# EAGLE design IoTaWatt_V4_2 (EAGLE 7.4.0)
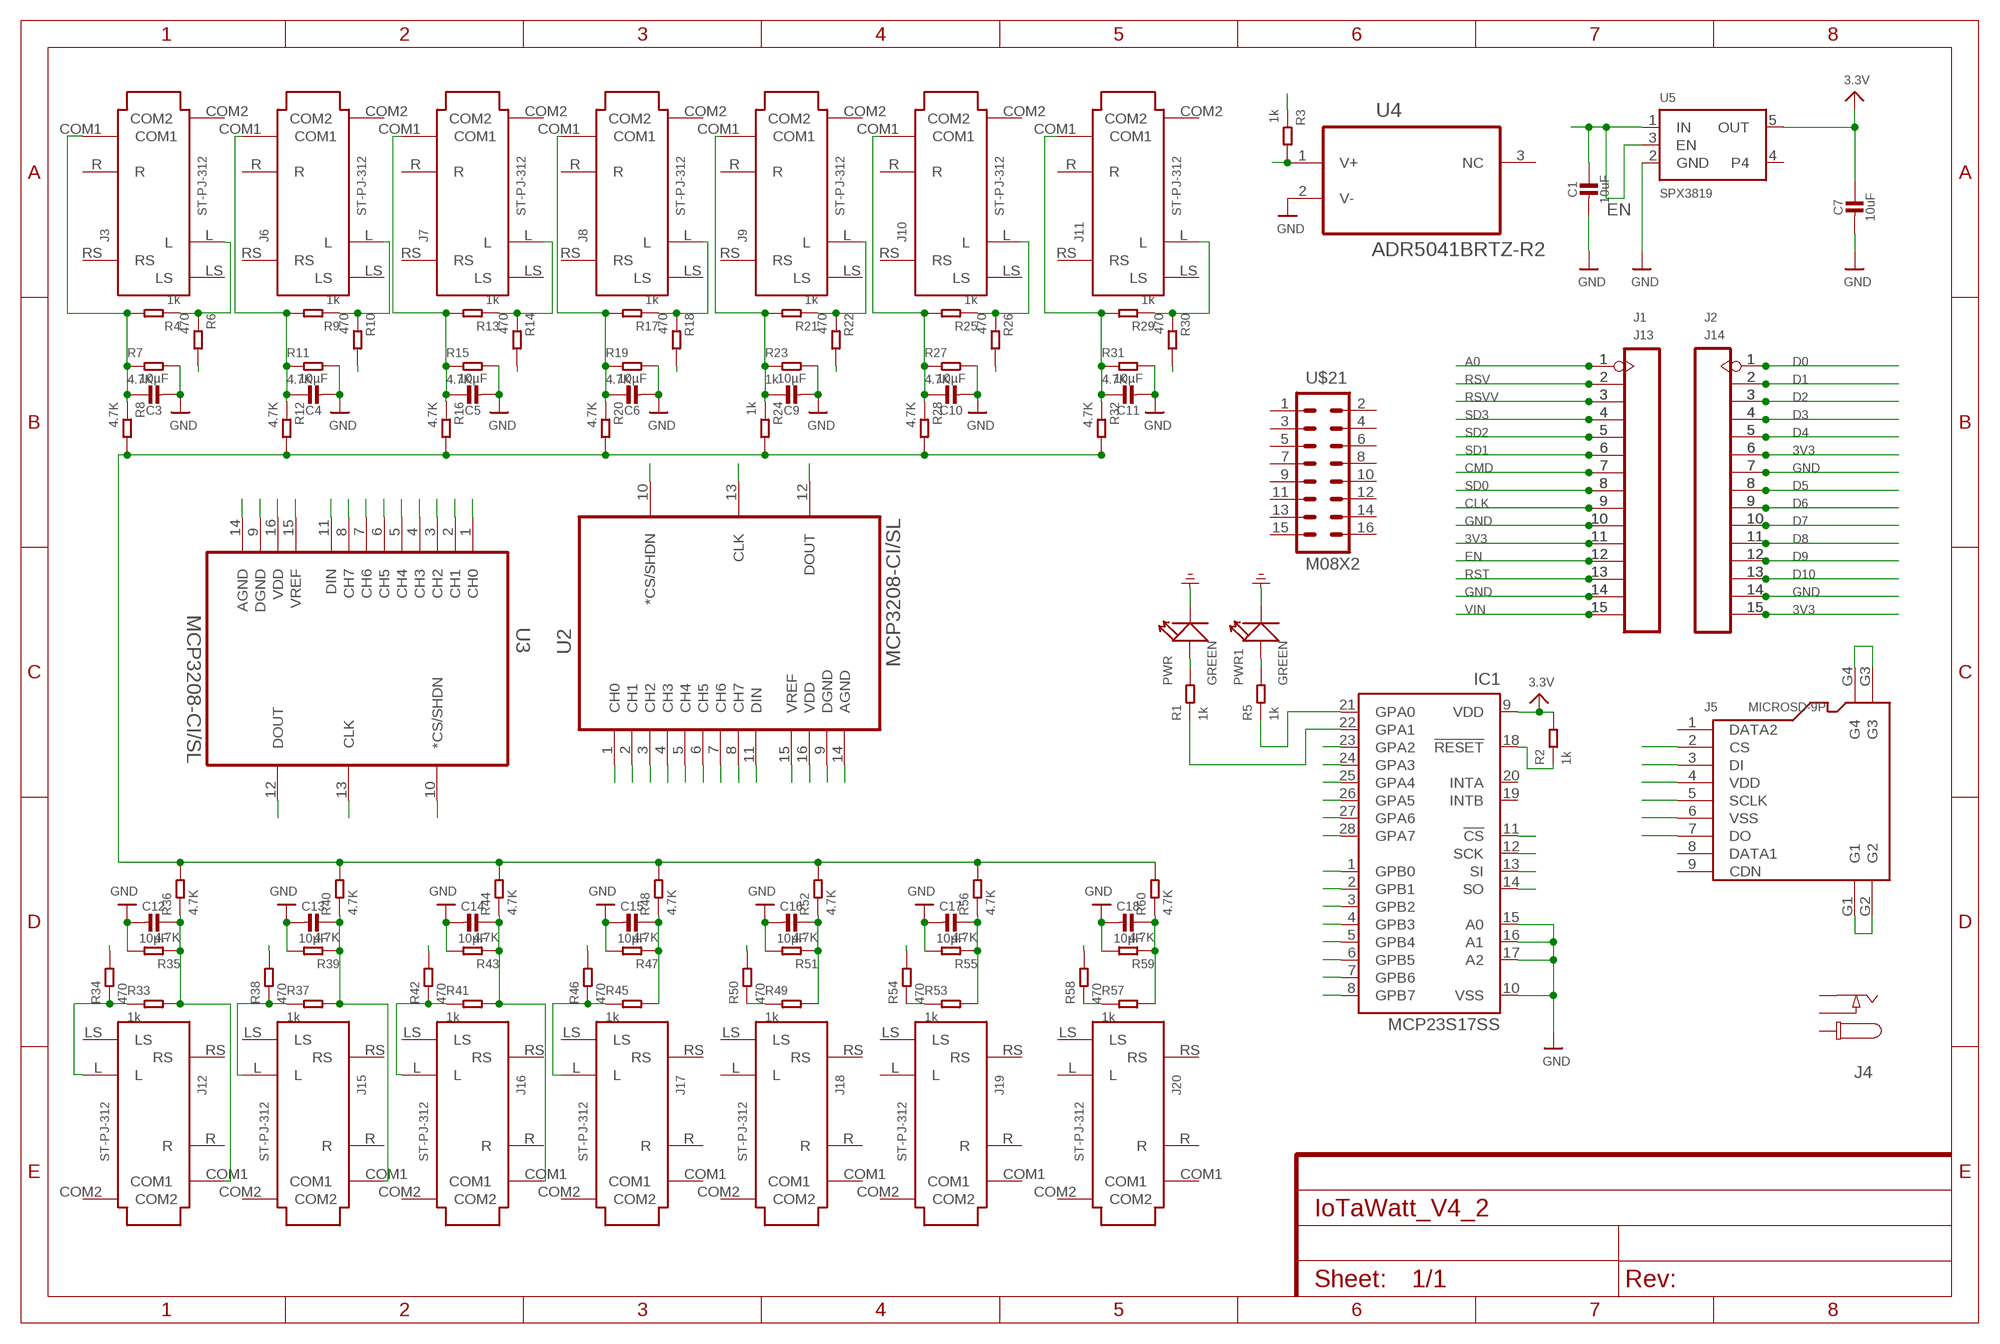
[diagram p0: schematic, sheet 1]

## Parts
C1  10uF  CAP_CERAMIC0603_NO  [0603-NO]
C3  10µF  CAP_CERAMIC0805-NOOUTLINE  [0805-NO]
C4  10µF  CAP_CERAMIC0805-NOOUTLINE  [0805-NO]
C5  10µF  CAP_CERAMIC0805-NOOUTLINE  [0805-NO]
C6  10µF  CAP_CERAMIC0805-NOOUTLINE  [0805-NO]
C7  10uF  CAP_CERAMIC0603_NO  [0603-NO]
C9  10µF  CAP_CERAMIC0805-NOOUTLINE  [0805-NO]
C10  10µF  CAP_CERAMIC0805-NOOUTLINE  [0805-NO]
C11  10µF  CAP_CERAMIC0805-NOOUTLINE  [0805-NO]
C12  10µF  CAP_CERAMIC0805-NOOUTLINE  [0805-NO]
C13  10µF  CAP_CERAMIC0805-NOOUTLINE  [0805-NO]
C14  10µF  CAP_CERAMIC0805-NOOUTLINE  [0805-NO]
C15  10µF  CAP_CERAMIC0805-NOOUTLINE  [0805-NO]
C16  10µF  CAP_CERAMIC0805-NOOUTLINE  [0805-NO]
C17  10µF  CAP_CERAMIC0805-NOOUTLINE  [0805-NO]
C18  10µF  CAP_CERAMIC0805-NOOUTLINE  [0805-NO]
IC1  MCP23S17SS  [SSOP28]
J1  HEADER-15P'2.54'  [H15-2.54]
J2  HEADER-15P'2.54'  [H15-2.54]
J3  ST-PJ-312  AUDIO-JACK-6P-SMD(ST-PJ-312)  [AUDIO6P-SMD-3.5-14.0X6.4X5.0MM]
J4  CON_DC_M-DC_SMD  [DC_BARREL_JACK_SMD_2MM]
J5  MICROSD-9P  MICRO-SD-CARD-HOLDER-9P  [MICRO-SD9+4P-SMD-16.1X14.5X1.85MM]
J6  ST-PJ-312  AUDIO-JACK-6P-SMD(ST-PJ-312)  [AUDIO6P-SMD-3.5-14.0X6.4X5.0MM]
J7  ST-PJ-312  AUDIO-JACK-6P-SMD(ST-PJ-312)  [AUDIO6P-SMD-3.5-14.0X6.4X5.0MM]
J8  ST-PJ-312  AUDIO-JACK-6P-SMD(ST-PJ-312)  [AUDIO6P-SMD-3.5-14.0X6.4X5.0MM]
J9  ST-PJ-312  AUDIO-JACK-6P-SMD(ST-PJ-312)  [AUDIO6P-SMD-3.5-14.0X6.4X5.0MM]
J10  ST-PJ-312  AUDIO-JACK-6P-SMD(ST-PJ-312)  [AUDIO6P-SMD-3.5-14.0X6.4X5.0MM]
J11  ST-PJ-312  AUDIO-JACK-6P-SMD(ST-PJ-312)  [AUDIO6P-SMD-3.5-14.0X6.4X5.0MM]
J12  ST-PJ-312  AUDIO-JACK-6P-SMD(ST-PJ-312)  [AUDIO6P-SMD-3.5-14.0X6.4X5.0MM]
J13  HEADER-15P'2.54'  [H15-2.54]
J14  HEADER-15P'2.54'  [H15-2.54]
J15  ST-PJ-312  AUDIO-JACK-6P-SMD(ST-PJ-312)  [AUDIO6P-SMD-3.5-14.0X6.4X5.0MM]
J16  ST-PJ-312  AUDIO-JACK-6P-SMD(ST-PJ-312)  [AUDIO6P-SMD-3.5-14.0X6.4X5.0MM]
J17  ST-PJ-312  AUDIO-JACK-6P-SMD(ST-PJ-312)  [AUDIO6P-SMD-3.5-14.0X6.4X5.0MM]
J18  ST-PJ-312  AUDIO-JACK-6P-SMD(ST-PJ-312)  [AUDIO6P-SMD-3.5-14.0X6.4X5.0MM]
J19  ST-PJ-312  AUDIO-JACK-6P-SMD(ST-PJ-312)  [AUDIO6P-SMD-3.5-14.0X6.4X5.0MM]
J20  ST-PJ-312  AUDIO-JACK-6P-SMD(ST-PJ-312)  [AUDIO6P-SMD-3.5-14.0X6.4X5.0MM]
PWR  GREEN  LED'0603'  [LED-0603]
PWR1  GREEN  LED'0603'  [LED-0603]
R1  1k  RES-0603  [R0603]
R2  1k  RES-0603  [R0603]
R3  1k  RES-0603  [R0603]
R4  1k  RES-0603  [R0603]
R5  1k  RES-0603  [R0603]
R6  470  RES-0603  [R0603]
R7  4.7K  RES-0603  [R0603]
R8  4.7K  RES-0603  [R0603]
R9  1k  RES-0603  [R0603]
R10  470  RES-0603  [R0603]
R11  4.7K  RES-0603  [R0603]
R12  4.7K  RES-0603  [R0603]
R13  1k  RES-0603  [R0603]
R14  470  RES-0603  [R0603]
R15  4.7K  RES-0603  [R0603]
R16  4.7K  RES-0603  [R0603]
R17  1k  RES-0603  [R0603]
R18  470  RES-0603  [R0603]
R19  4.7K  RES-0603  [R0603]
R20  4.7K  RES-0603  [R0603]
R21  1k  RES-0603  [R0603]
R22  470  RES-0603  [R0603]
R23  1k  RES-0603  [R0603]
R24  1k  RES-0603  [R0603]
R25  1k  RES-0603  [R0603]
R26  470  RES-0603  [R0603]
R27  4.7K  RES-0603  [R0603]
R28  4.7K  RES-0603  [R0603]
R29  1k  RES-0603  [R0603]
R30  470  RES-0603  [R0603]
R31  4.7K  RES-0603  [R0603]
R32  4.7K  RES-0603  [R0603]
R33  1k  RES-0603  [R0603]
R34  470  RES-0603  [R0603]
R35  4.7K  RES-0603  [R0603]
R36  4.7K  RES-0603  [R0603]
R37  1k  RES-0603  [R0603]
R38  470  RES-0603  [R0603]
R39  4.7K  RES-0603  [R0603]
R40  4.7K  RES-0603  [R0603]
R41  1k  RES-0603  [R0603]
R42  470  RES-0603  [R0603]
R43  4.7K  RES-0603  [R0603]
R44  4.7K  RES-0603  [R0603]
R45  1k  RES-0603  [R0603]
R46  470  RES-0603  [R0603]
R47  4.7K  RES-0603  [R0603]
R48  4.7K  RES-0603  [R0603]
R49  1k  RES-0603  [R0603]
R50  470  RES-0603  [R0603]
R51  4.7K  RES-0603  [R0603]
R52  4.7K  RES-0603  [R0603]
R53  1k  RES-0603  [R0603]
R54  470  RES-0603  [R0603]
R55  4.7K  RES-0603  [R0603]
R56  4.7K  RES-0603  [R0603]
R57  1k  RES-0603  [R0603]
R58  470  RES-0603  [R0603]
R59  4.7K  RES-0603  [R0603]
R60  4.7K  RES-0603  [R0603]
U2  MCP3208-CI/SL  [SOIC127P600X175-16N]
U3  MCP3208-CI/SL  [SOIC127P600X175-16N]
U4  ADR5041BRTZ-R2  [SOT95P237X112-3N]
U5  SPX3819  VREG_SOT23-5  [SOT23-5]
U$21  M08X2  [2X8]

## Nets
3V3: C7.1 IC1.9(VDD) J1.11 J2.6 J2.15 J5.4(VDD) J13.11 J14.6 J14.15 R2.2 U5.5(OUT) ; supply symbol labelled 3.3V
A0: J1.1 J13.1
CLK: J1.9 J13.9
CMD: J1.7 J13.7
D0: J2.1 J14.1
D1: J2.2 J14.2
D2: J2.3 J14.3
D3: J2.4 J14.4
D4: J2.5 J14.5
D5: J2.8 J5.5(SCLK) J14.8
D6: J2.9 J5.7(DO) J14.9
D7: J2.10 J5.3(DI) J14.10
D8: J2.11 J5.2(CS) J14.11
D9: J2.12 J14.12
D10: J2.13 J14.13
EN: C1.1 J1.12 J13.12 U5.1(IN) U5.3(EN)
GND [pwr]: C1.2 C3.2 C4.2 C5.2 C6.2 C7.2 C9.2 C10.2 C11.2 C12.2 C13.2 C14.2 C15.2 C16.2 C17.2 C18.2 IC1.10(VSS) IC1.15(A0) IC1.16(A1) IC1.17(A2) J1.10 J1.14 J2.7 J2.14 J5.6(VSS) J13.10 J13.14 J14.7 J14.14 PWR1.- PWR.- R7.2 R11.2 R15.2 R19.2 R23.2 R27.2 R31.2 R35.2 R39.2 R43.2 R47.2 R51.2 R55.2 R59.2 U4.2(V-) U5.2(GND) ; supply symbol labelled GND_POWER
N$1: PWR.+ R1.2
N$2: PWR1.+ R5.2
N$3: IC1.21(GPA0) R5.1
N$4: IC1.22(GPA1) R1.1
N$5: C3.1 J3.COM1 R4.2 R7.1 R8.1
N$6: J3.L R4.1 R6.1
N$7: R3.2 U4.1(V+)
N$8: R6.2
N$9: C4.1 J6.COM1 R9.2 R11.1 R12.1
N$10: J6.L R9.1 R10.1
N$11: J5.G1 J5.G2
N$12: R10.2
N$13: C5.1 J7.COM1 R13.2 R15.1 R16.1
N$14: J7.L R13.1 R14.1
N$15: J5.G3 J5.G4
N$16: R14.2
N$17: C6.1 J8.COM1 R17.2 R19.1 R20.1
N$18: J8.L R17.1 R18.1
N$19: R8.2 R12.2 R16.2 R20.2 R24.2 R28.2 R32.2 R36.2 R40.2 R44.2 R48.2 R52.2 R56.2 R60.2
N$20: R18.2
N$21: C9.1 J9.COM1 R21.2 R23.1 R24.1
N$22: J9.L R21.1 R22.1
N$23: U3.15(VREF)
N$24: R22.2
N$25: C10.1 J10.COM1 R25.2 R27.1 R28.1
N$26: J10.L R25.1 R26.1
N$27: U3.16(VDD)
N$28: R26.2
N$29: C11.1 J11.COM1 R29.2 R31.1 R32.1
N$30: J11.L R29.1 R30.1
N$31: U3.9(DGND)
N$32: R30.2
N$33: C12.1 J12.COM1 R33.2 R35.1 R36.1
N$34: J12.L R33.1 R34.1
N$35: U3.14(AGND)
N$36: R34.2
N$37: C13.1 J15.COM1 R37.2 R39.1 R40.1
N$38: J15.L R37.1 R38.1
N$39: U3.11(DIN)
N$40: R38.2
N$41: C14.1 J16.COM1 R41.2 R43.1 R44.1
N$42: J16.L R41.1 R42.1
N$43: U3.8(CH7)
N$44: R42.2
N$45: C15.1 R45.2 R47.1 R48.1
N$46: J17.L R45.1 R46.1
N$47: U3.7(CH6)
N$48: R46.2
N$49: C16.1 R49.2 R51.1 R52.1
N$50: R49.1 R50.1
N$51: U3.6(CH5)
N$52: R50.2
N$53: C17.1 R53.2 R55.1 R56.1
N$54: R53.1 R54.1
N$55: U3.5(CH4)
N$56: R54.2
N$57: C18.1 R57.2 R59.1 R60.1
N$58: R57.1 R58.1
N$59: U3.4(CH3)
N$60: R58.2
N$61: IC1.23(GPA2)
N$62: IC1.24(GPA3)
N$63: IC1.25(GPA4)
N$64: IC1.26(GPA5)
N$65: IC1.27(GPA6)
N$66: IC1.28(GPA7)
N$67: IC1.12(SCK)
N$68: IC1.11(!CS)
N$69: IC1.13(SI)
N$70: IC1.14(SO)
N$71: IC1.1(GPB0)
N$72: IC1.18(!RESET) R2.1
N$73: IC1.2(GPB1)
N$74: IC1.3(GPB2)
N$75: IC1.4(GPB3)
N$76: IC1.5(GPB4)
N$77: IC1.6(GPB5)
N$78: IC1.7(GPB6)
N$79: IC1.8(GPB7)
N$80: U2.10(*CS/SHDN)
N$81: U2.13(CLK)
N$82: U2.12(DOUT)
N$83: U3.3(CH2)
N$84: U3.2(CH1)
N$85: U3.1(CH0)
N$86: U3.12(DOUT)
N$87: U3.13(CLK)
N$88: U3.10(*CS/SHDN)
N$89: U2.1(CH0)
N$90: U2.2(CH1)
N$91: U2.3(CH2)
N$92: U2.4(CH3)
N$93: U2.5(CH4)
N$94: U2.6(CH5)
N$95: U2.7(CH6)
N$96: U2.8(CH7)
N$97: U2.11(DIN)
N$98: U2.15(VREF)
N$99: U2.16(VDD)
N$100: U2.9(DGND)
N$101: U2.14(AGND)
N$102: R3.1
RST: J1.13 J13.13
RSV: J1.2 J13.2
RSVV: J1.3 J13.3
SD0: J1.8 J13.8
SD1: J1.6 J13.6
SD2: J1.5 J13.5
SD3: J1.4 J13.4
VIN [pwr]: J1.15 J13.15
Unconnected: IC1.19(INTB) IC1.20(INTA) J3.COM2 J3.LS J3.R J3.RS J4.P1@2(P1) J4.P2 J4.P3 J5.1(DATA2) J5.8(DATA1) J5.9(CDN) J6.COM2 J6.LS J6.R J6.RS J7.COM2 J7.LS J7.R J7.RS J8.COM2 J8.LS J8.R J8.RS J9.COM2 J9.LS J9.R J9.RS J10.COM2 J10.LS J10.R J10.RS J11.COM2 J11.LS J11.R J11.RS J12.COM2 J12.LS J12.R J12.RS J15.COM2 J15.LS J15.R J15.RS J16.COM2 J16.LS J16.R J16.RS J17.COM1 J17.COM2 J17.LS J17.R J17.RS J18.COM1 J18.COM2 J18.L J18.LS J18.R J18.RS J19.COM1 J19.COM2 J19.L J19.LS J19.R J19.RS J20.COM1 J20.COM2 J20.L J20.LS J20.R J20.RS U4.3(NC) U5.4 U$21.1 U$21.2 U$21.3 U$21.4 U$21.5 U$21.6 U$21.7 U$21.8 U$21.9 U$21.10 U$21.11 U$21.12 U$21.13 U$21.14 U$21.15 U$21.16

## Library data of the parts
C1 C3-C7 C9-C18 = microbuilder:CAP_CERAMIC: Ceramic Capacitors For new designs, use the packages preceded by an '_' character since they are more reliable: The following footprints should be used on most boards: _0402 - Standard footprint for regular board layouts _0603 - Standard footprint for regular board layouts _0805 - Standard footprint for regular board layouts _1206 - Standard footprint for regular board layouts For extremely tight-pitch boards where space is at a premium, the following 'micro-pitch' footprints can be used (smaller pads, no silkscreen outline, etc.): _0402MP - Micro-pitch footprint for very dense/compact boards _0603MP - Micro-pitch footprint for very dense/compact boards _0805MP - Micro-pitch footprint for very dense/compact boards _1206MP - Micro-pitch footprint for very dense/compact boards
IC1 = microchip:MCP23S17: http://ww1.microchip.com/downloads/en/DeviceDoc/21952a.pdf Source: http://ww1.microchip.com/downloads/en/DeviceDoc/21952a.pdf; MF: MICROCHIP; MPN: MCP23S17-E/SS; OC_FARNELL: 1467675; OC_NEWARK: 31K2952
J1 J2 J13 J14 = Connector-new:HEADER-15P: Header 15 Standard 15-pin 0.1" header. Use with straight break away headers (SKU : PRT-00116), right angle break away headers (PRT-00553), swiss pins (PRT-00743), machine pins (PRT-00117), and female headers (PRT-00115).
J3 J6-J12 J15-J20 = Seeed-OPL-Connector:AUDIO-JACK-6P-SMD(ST-PJ-312): 320040007; MPN: ST-PJ-312
J4 = dp_devices:CON_DC_M: DC power connector
J5 = Seeed-Connector -2016:MICRO-SD-CARD-HOLDER-9P: 320090008
PWR PWR1 = Discrete-new:LED
R1-R60 = Discrete-new:RES
U2 U3 = Microchip_By_element14_Batch_1:MCP3208-CI/SL: IC, 12 ADC, SMD, 3208; MPN: MCP3208-CI/SL; OC_FARNELL: 1084270; OC_NEWARK: 69K7605; PACKAGE: SOIC16; SUPPLIER: Microchip
U4 = Analog Devices_By_element14_Batch_1:ADR5041BRTZ-R2: Precision Micropower Shunt Mode Voltage References; MPN: ADR5041BRTZ-R2; OC_FARNELL: 1814352; OC_NEWARK: 34M4886; PACKAGE: SOT-23-3; SUPPLIER: Analog Devices
U5 = microbuilder:VREG_SOT23-5: SOT23-5 Fixed Voltage Regulators Part Current Out V Out V In V Dropout θJA (°C/W) TJ (°C) Digikey Part No. ADP121 150mA 3.3V 3.4-5.5V 0.09V @ 150mA -- -- ADP121-AUJZ33R7CT-ND ADP121 150mA 3.0V 3.1-5.5V 0.09V @ 150mA -- -- ADP121-AUJZ30R7CT-ND ADP122 300mA 3.3V 3.4-5.5V 0.085V @ 300mA -- -- ADP122AUJZ-3.3-R7CT-ND ADP1712 300mA 3.3V 3.5-5.5V 0.17V @ 300mA -- -- ADP1712AUJZ-3.3-R7TR-ND AP7311 (Low Cost) 150mA 3.3V 3.5-6V 0.15V @ 150mA -- -- AP7311-33WG-7DICT-ND LD39015M18R 150mA 1.8V 1.9V-5.5V 0.08V @ 100mA -- -- 497-6977-1-ND LP2985A-33DBVR 150mA 3.3V 3.3-16V 0.28V @ 150mA 206 150 296-18479-1-ND MCP1824T-3302E/OT 300mA 3.3V 3.5V-6V 0.2V @ 300mA -- -- MCP1824T-3302E/OTCT-ND MIC5205-2.5YM5 TR 150mA 2.5V 2.7-16V 0.165V @ 150mA -- -- 576-1257-2-ND MIC5205-3.0YM5 TR 150mA 3.0V 3.2V-16V 0.165V @ 150mA -- -- 576-1258-2-ND MIC5205-3.3YM5 TR 150mA 3.3V 3.5V-16V 0.165V @ 150mA -- -- 576-1259-2-ND TPS780330220 150mA 3.3V+2.2V 3.6-5.5V 250mV Max -- -- 296-23332-1-ND TDA3663/N1,135 100mA 3.3V 3.5-45V 0.18V @ 50mA -- -- 568-5343-1-ND Max operating temp can be calculated using θJA, TJ (max junction temperature), and power in watts. Set the "Maximum Ambient Temperature" until it reaches TJ ("Max Junction Temperature"), which is the absolute limit for safe use of the regulator: Heat Sink Temperature Calculator <http://www.daycounter.com/Calculators/Heat-Sink-Temperature-Calculator.phtml> For example, With 12V source into a 3.3V LP2985 and a 30mA load, we are dissipating (12V-3.3V) * 0.03A = 0.261W. With a θJA of 206 °C/W, a TJ of 150°C, and 261mW we can safely use the chip without a heat sink up to 75°C (=147.1°C Junction Temperature).
U$21 = SparkFun-Connectors:M08X2: .1" headers, two rows of 8 each

## Net classes
0 default: width 0.152 mm, drill 0.33 mm, clearance 0.152 mm
1 pwr: width 0.406 mm, drill 0.356 mm, clearance 0.203 mm

## Board
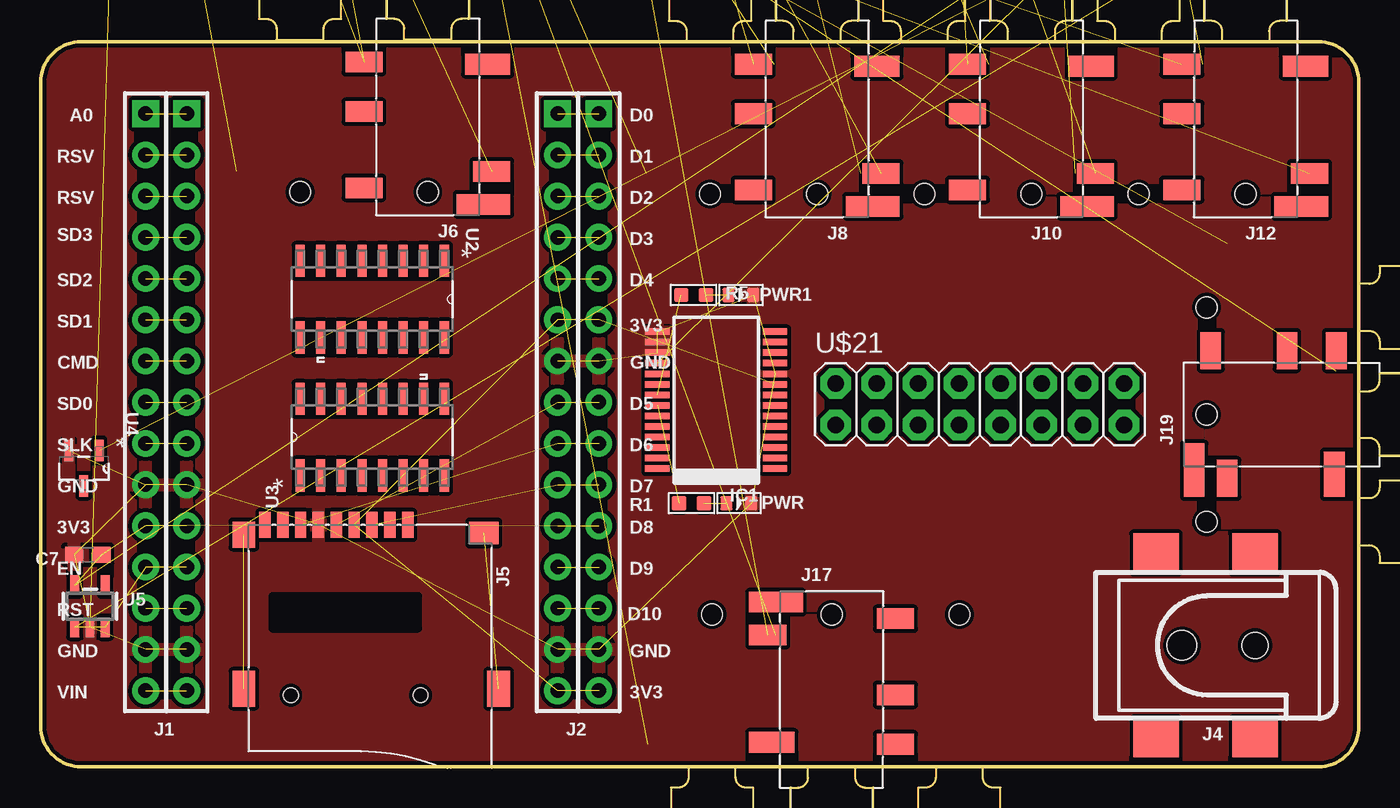
[diagram p1: board, top side]
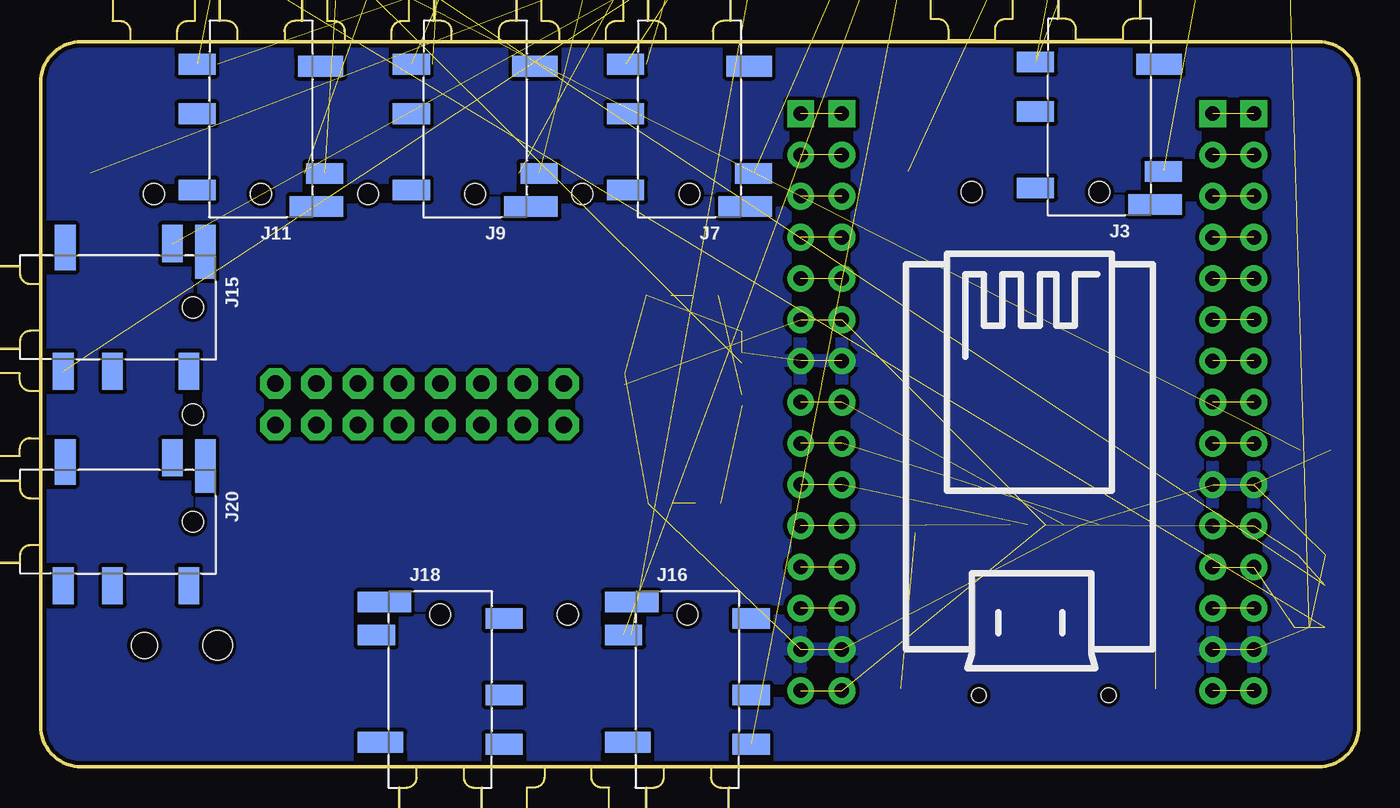
[diagram p2: board, bottom side, seen from below]

Size 81.28 x 44.7 mm. Coordinates in mm from the lower left corner, seen from the top.
Outline: 2.54,0 78.74,0 arc90 81.28,2.54 81.28,42.16 arc90 78.74,44.7 2.54,44.7 arc90 0,42.16 0,2.54 arc90 2.54,0
Copper layers (1*16): Top 0.035mm / dielectric 1.5mm / Bottom 0.035mm
Design rules "hackvana": minimum track width 6mil, minimum drill 0.3mm, track to track 6mil, track to pad 6mil, pad to pad 6mil, via to via 6mil, smd to smd 0mil, copper to edge 6mil, drill to drill 6mil, minimum pad ring 10mil, minimum via ring 6mil, stop-mask expansion 2mil, vias tented up to drill 100mil, thermal gap 10mil

### Footprints (pad centres in the part's own frame; a part is rotated, then mirrored left to right if it is on the bottom)
0603-NO = smd 1.1 x 1: 1 -0.85,0; 2 0.85,0
0805-NO = smd 1.24 x 1.5: 1 -0.95,0; 2 0.95,0
SSOP28 = smd 0.4 x 1.5: 1 -4.225,-3.625; 2 -3.575,-3.625; 3 -2.925,-3.625; 4 -2.275,-3.625; 5 -1.625,-3.625; 6 -0.975,-3.625; 7 -0.325,-3.625; 8 0.325,-3.625; 9 0.975,-3.625; 10 1.625,-3.625; 11 2.275,-3.625; 12 2.925,-3.625; 13 3.575,-3.625; 14 4.225,-3.625; 15 4.225,3.625; 16 3.575,3.625; 17 2.925,3.625; 18 2.275,3.625; 19 1.625,3.625; 20 0.975,3.625; 21 0.325,3.625; 22 -0.325,3.625; 23 -0.975,3.625; 24 -1.625,3.625; 25 -2.275,3.625; 26 -2.925,3.625; 27 -3.575,3.625; 28 -4.225,3.625
H15-2.54 = drill 0.889 pad 1.651 square: 1 0,-17.78 | drill 0.889 pad 1.651: 2 0,-15.24; 3 0,-12.7; 4 0,-10.16; 5 0,-7.62; 6 0,-5.08; 7 0,-2.54; 8 0,0; 9 0,2.54; 10 0,5.08; 11 0,7.62; 12 0,10.16; 13 0,12.7; 14 0,15.24; 15 0,17.78
AUDIO6P-SMD-3.5-14.0X6.4X5.0MM = smd 1.27 x 2.286: COM1 -4.572,3.937; L -11.303,-3.937; R -7.62,3.937; RS -12.319,3.937 | smd 1.27 x 2.794: COM2 -4.699,-3.683 | smd 1.27 x 3.302: LS -13.335,-3.429 | hole 1.27: -12.573,0
DC_BARREL_JACK_SMD_2MM = smd 2.4 x 2.8: P1@1 -5.7,3.875; P1@2 -5.7,-2.225; P2 5.7,-2.225; P3 5.7,3.875 | hole 1.8: 0,2.275 | hole 1.6: 0,-2.225
MICRO-SD9+4P-SMD-16.1X14.5X1.85MM = smd 1.6 x 0.7: 1 0,2.25; 2 0,1.15; 3 0,0.05; 4 0,-1.05; 5 0,-2.15; 6 0,-3.25; 7 0,-4.35; 8 0,-5.45; 9 0,-6.55 | smd 1.6 x 1.4: G1 0.6,-7.85 | smd 2.2 x 1.4: G2 10.1,-7.85; G3 10.1,7.85 | smd 1.4 x 1.8: G4 0.5,6.95 | hole 0.9: 10.5,-4.95; 10.5,3.05
LED-0603 = smd 0.762 x 0.889: + -0.762,0; - 0.762,0
R0603 = smd 0.889 x 0.889: 1 0,0.762; 2 0,-0.762
SOIC127P600X175-16N = smd 1.981 x 0.559: 1 -2.362,4.445; 2 -2.362,3.175; 3 -2.362,1.905; 4 -2.362,0.635; 5 -2.362,-0.635; 6 -2.362,-1.905; 7 -2.362,-3.175; 8 -2.362,-4.445; 9 2.362,-4.445; 10 2.362,-3.175; 11 2.362,-1.905; 12 2.362,-0.635; 13 2.362,0.635; 14 2.362,1.905; 15 2.362,3.175; 16 2.362,4.445
SOT95P237X112-3N = smd 1.321 x 0.559: 1 -1.092,0.94; 2 -1.092,-0.94; 3 1.092,0
SOT23-5 = smd 0.55 x 1.2: 1 -0.95,-1.3; 2 0,-1.3; 3 0.95,-1.3; 4 0.95,1.3; 5 -0.95,1.3
2X8 = drill 1.016 pad 1.88 octagon: 1 0,0; 2 0,2.54; 3 2.54,0; 4 2.54,2.54; 5 5.08,0; 6 5.08,2.54; 7 7.62,0; 8 7.62,2.54; 9 10.16,0; 10 10.16,2.54; 11 12.7,0; 12 12.7,2.54; 13 15.24,0; 14 15.24,2.54; 15 17.78,0; 16 17.78,2.54

### Placement (x,y rotation side)
C1  75.95,54.1 90 top  (outside the outline)
C3  7.87,75.18 90 top  (outside the outline)
C4  18.16,71.75 90 top  (outside the outline)
C5  28.45,71.75 90 top  (outside the outline)
C6  38.73,71.75 90 top  (outside the outline)
C7  2.92,13.08 180 top
C9  49.02,71.75 90 top  (outside the outline)
C10  59.31,71.75 90 top  (outside the outline)
C11  1.52,61.21 90 top  (outside the outline)
C12  11.81,61.21 90 top  (outside the outline)
C13  22.1,61.21 90 top  (outside the outline)
C14  32.38,61.21 90 top  (outside the outline)
C15  42.67,61.21 90 top  (outside the outline)
C16  52.96,61.21 90 top  (outside the outline)
C17  63.25,61.21 90 top  (outside the outline)
C18  73.53,61.21 90 top  (outside the outline)
IC1  41.66,22.61 90 top
J1  6.48,22.48 180 top
J2  31.88,22.48 180 top
J3  16,48.01 90 bottom
J4  72.64,7.49 90 top
J5  20.38,14.92 270 top
J6  23.88,48.01 90 top
J7  41.27,47.88 90 bottom
J8  47.88,47.88 90 top
J9  54.48,47.88 90 bottom
J10  61.09,47.88 90 top
J11  67.69,47.88 90 bottom
J12  74.3,47.88 90 top
J13  9.02,22.48 180 top
J14  34.42,22.48 180 top
J15  84.45,28.32 180 bottom
J16  41.4,-3.17 270 bottom
J17  48.77,-3.17 270 top
J18  56.64,-3.17 270 bottom
J19  84.45,21.72 0 top
J20  84.45,15.11 180 bottom
PWR  43.05,16.26 0 top
PWR1  43.18,29.08 0 top
R1  40.13,16.26 90 top
R2  72.39,58.29 90 top  (outside the outline)
R3  72.39,54.86 90 top  (outside the outline)
R4  4.32,82.55 90 top  (outside the outline)
R5  40.26,29.08 90 top
R6  4.32,79.12 90 top  (outside the outline)
R7  4.32,75.69 90 top  (outside the outline)
R8  6.73,72.26 90 top  (outside the outline)
R9  10.67,72.26 90 top  (outside the outline)
R10  10.67,75.69 90 top  (outside the outline)
R11  14.61,72.26 90 top  (outside the outline)
R12  14.61,75.69 90 top  (outside the outline)
R13  20.95,72.26 90 top  (outside the outline)
R14  20.95,75.69 90 top  (outside the outline)
R15  24.89,72.26 90 top  (outside the outline)
R16  24.89,75.69 90 top  (outside the outline)
R17  31.24,72.26 90 top  (outside the outline)
R18  31.24,75.69 90 top  (outside the outline)
R19  35.18,72.26 90 top  (outside the outline)
R20  35.18,75.69 90 top  (outside the outline)
R21  41.53,72.26 90 top  (outside the outline)
R22  41.53,75.69 90 top  (outside the outline)
R23  45.47,72.26 90 top  (outside the outline)
R24  45.47,75.69 90 top  (outside the outline)
R25  51.82,72.26 90 top  (outside the outline)
R26  51.82,75.69 90 top  (outside the outline)
R27  55.75,72.26 90 top  (outside the outline)
R28  55.75,75.69 90 top  (outside the outline)
R29  62.1,72.26 90 top  (outside the outline)
R30  62.1,75.69 90 top  (outside the outline)
R31  66.04,72.26 90 top  (outside the outline)
R32  66.04,75.69 90 top  (outside the outline)
R33  4.32,61.72 90 top  (outside the outline)
R34  4.32,65.15 90 top  (outside the outline)
R35  8.26,61.72 90 top  (outside the outline)
R36  8.26,65.15 90 top  (outside the outline)
R37  14.61,61.72 90 top  (outside the outline)
R38  14.61,65.15 90 top  (outside the outline)
R39  18.54,61.72 90 top  (outside the outline)
R40  18.54,65.15 90 top  (outside the outline)
R41  24.89,61.72 90 top  (outside the outline)
R42  24.89,65.15 90 top  (outside the outline)
R43  28.83,61.72 90 top  (outside the outline)
R44  28.83,65.15 90 top  (outside the outline)
R45  35.18,61.72 90 top  (outside the outline)
R46  35.18,65.15 90 top  (outside the outline)
R47  39.12,61.72 90 top  (outside the outline)
R48  39.12,65.15 90 top  (outside the outline)
R49  45.47,61.72 90 top  (outside the outline)
R50  45.47,65.15 90 top  (outside the outline)
R51  49.4,61.72 90 top  (outside the outline)
R52  49.4,65.15 90 top  (outside the outline)
R53  55.75,61.72 90 top  (outside the outline)
R54  55.75,65.15 90 top  (outside the outline)
R55  59.69,61.72 90 top  (outside the outline)
R56  59.69,65.15 90 top  (outside the outline)
R57  66.04,61.72 90 top  (outside the outline)
R58  66.04,65.15 90 top  (outside the outline)
R59  69.98,61.72 90 top  (outside the outline)
R60  69.98,65.15 90 top  (outside the outline)
U2  20.45,28.83 270 top
U3  20.45,20.32 90 top
U4  2.67,18.41 270 top
U5  3.05,9.91 0 top
U$21  49.02,21.08 0 top

### Tracks (layer width: path | path; a pad name or v marks a point on that pad's centre or on a via)
3V3  (10 unrouted)
A0  (1 unrouted)
CLK  (1 unrouted)
CMD  (1 unrouted)
D0  (1 unrouted)
D1  (1 unrouted)
D2  (1 unrouted)
D3  (1 unrouted)
D4  (1 unrouted)
D5  (2 unrouted)
D6  (2 unrouted)
D7  (2 unrouted)
D8  (2 unrouted)
D9  (1 unrouted)
D10  (1 unrouted)
EN  (4 unrouted)
GND  (46 unrouted)
  pour Top (isolate 0.254, rank 6): -0.64,46.35 81.28,46.35 81.28,-0.64 -0.64,-0.64
  pour Bottom (isolate 0.254, rank 6): -0.64,46.35 81.28,46.35 81.28,-0.64 -0.64,-0.64
N$1  (1 unrouted)
N$2  (1 unrouted)
N$3  (1 unrouted)
N$4  (1 unrouted)
N$5  (4 unrouted)
N$6  (2 unrouted)
N$7  (1 unrouted)
N$9  (4 unrouted)
N$10  (2 unrouted)
N$11  (1 unrouted)
N$13  (4 unrouted)
N$14  (2 unrouted)
N$15  (1 unrouted)
N$17  (4 unrouted)
N$18  (2 unrouted)
N$19  (13 unrouted)
N$21  (4 unrouted)
N$22  (2 unrouted)
N$25  (4 unrouted)
N$26  (2 unrouted)
N$29  (4 unrouted)
N$30  (2 unrouted)
N$33  (4 unrouted)
N$34  (2 unrouted)
N$37  (4 unrouted)
N$38  (2 unrouted)
N$41  (4 unrouted)
N$42  (2 unrouted)
N$45  (3 unrouted)
N$46  (2 unrouted)
N$49  (3 unrouted)
N$50  (1 unrouted)
N$53  (3 unrouted)
N$54  (1 unrouted)
N$57  (3 unrouted)
N$58  (1 unrouted)
N$72  (1 unrouted)
RST  (1 unrouted)
RSV  (1 unrouted)
RSVV  (1 unrouted)
SD0  (1 unrouted)
SD1  (1 unrouted)
SD2  (1 unrouted)
SD3  (1 unrouted)
VIN  (1 unrouted)

### Text on the board
tNames: A0 | D0 | RSV | D1 | RSV | D2 | SD3 | D3 | SD2 | D4 | SD1 | 3V3 | CMD | GND | SD0 | D5 | SLK | D6 | GND | D7 | 3V3 | D8 | EN | D9 | RST | D10 | GND | GND | VIN | 3V3